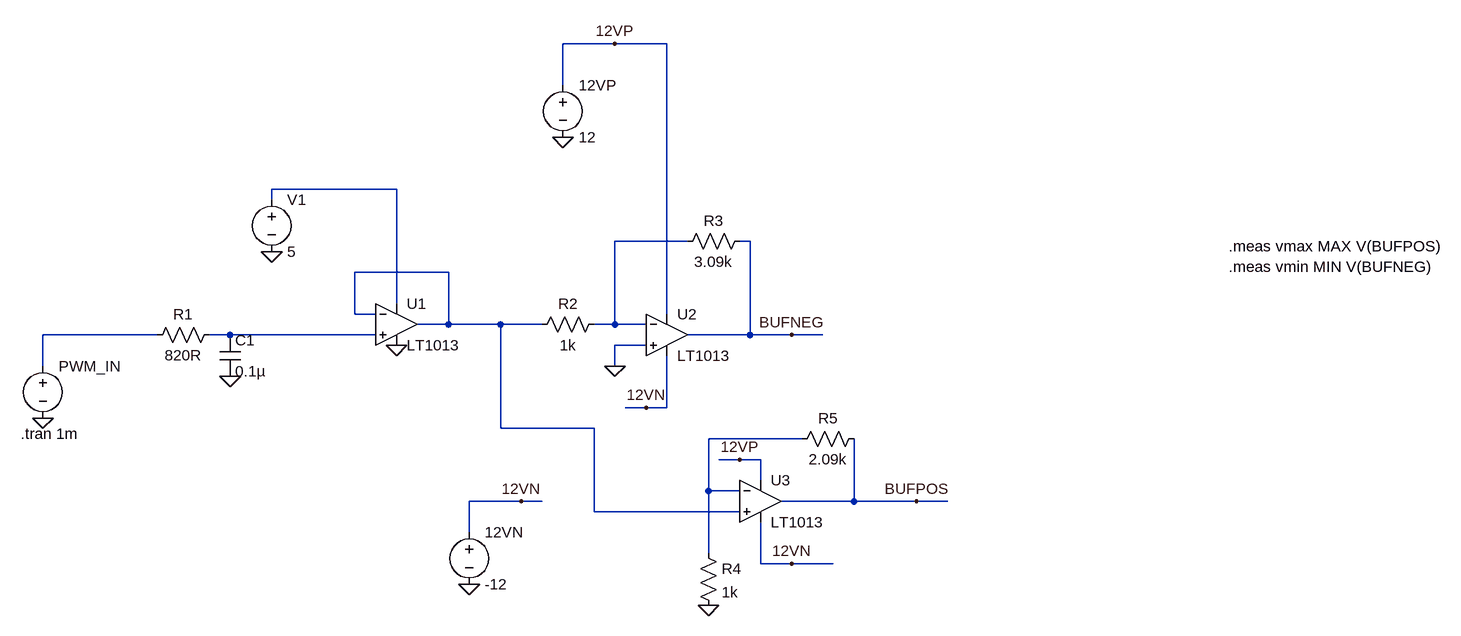
[diagram p0: schematic pwmdir-to-analog.asc]
pwmdir-to-analog.asc, the LTspice schematic file:
Version 4
SHEET 1 2236 680
WIRE 912 -368 832 -368
WIRE 992 -368 912 -368
WIRE 832 -304 832 -368
WIRE 576 -144 384 -144
WIRE 384 -128 384 -144
WIRE 1024 -64 912 -64
WIRE 1120 -64 1104 -64
WIRE 656 -16 512 -16
WIRE 576 32 576 -144
WIRE 512 48 512 -16
WIRE 544 48 512 48
WIRE 992 48 992 -368
WIRE 656 64 656 -16
WIRE 656 64 608 64
WIRE 736 64 656 64
WIRE 800 64 736 64
WIRE 912 64 912 -64
WIRE 912 64 880 64
WIRE 960 64 912 64
WIRE 208 80 32 80
WIRE 320 80 288 80
WIRE 544 80 320 80
WIRE 1120 80 1120 -64
WIRE 1120 80 1024 80
WIRE 1184 80 1120 80
WIRE 1232 80 1184 80
WIRE 960 96 912 96
WIRE 32 128 32 80
WIRE 912 128 912 96
WIRE 960 192 928 192
WIRE 992 192 992 112
WIRE 992 192 960 192
WIRE 736 224 736 64
WIRE 880 224 736 224
WIRE 1200 240 1056 240
WIRE 1104 272 1072 272
WIRE 1136 272 1104 272
WIRE 1136 304 1136 272
WIRE 1056 320 1056 240
WIRE 1104 320 1056 320
WIRE 768 336 688 336
WIRE 800 336 768 336
WIRE 1280 336 1280 240
WIRE 1280 336 1168 336
WIRE 1376 336 1280 336
WIRE 1424 336 1376 336
WIRE 880 352 880 224
WIRE 1104 352 880 352
WIRE 688 384 688 336
WIRE 1056 416 1056 320
WIRE 1136 432 1136 368
WIRE 1184 432 1136 432
WIRE 1248 432 1184 432
FLAG 32 208 0
FLAG 320 144 0
FLAG 384 -48 0
FLAG 576 96 0
FLAG 832 -224 0
FLAG 688 464 0
FLAG 912 -368 12VP
FLAG 768 336 12VN
FLAG 960 192 12VN
FLAG 912 128 0
FLAG 1184 80 BUFNEG
FLAG 1056 496 0
FLAG 1376 336 BUFPOS
FLAG 1184 432 12VN
FLAG 1104 272 12VP
SYMBOL voltage 32 112 R0
WINDOW 3 24 96 Invisible 2
WINDOW 123 0 0 Left 0
WINDOW 39 0 0 Left 0
SYMATTR InstName PWM_IN
SYMATTR Value PULSE(0 3.3 0 10n 10n 0.5u 1u)
SYMBOL res 304 64 R90
WINDOW 0 0 56 VBottom 2
WINDOW 3 32 56 VTop 2
SYMATTR InstName R1
SYMATTR Value 820R
SYMBOL cap 304 80 R0
SYMATTR InstName C1
SYMATTR Value 0.1µ
SYMBOL OpAmps\\LT1013 576 0 R0
SYMATTR InstName U1
SYMBOL voltage 384 -144 R0
WINDOW 123 0 0 Left 0
WINDOW 39 0 0 Left 0
SYMATTR InstName V1
SYMATTR Value 5
SYMBOL OpAmps\\LT1013 992 16 R0
SYMATTR InstName U2
SYMBOL res 896 48 R90
WINDOW 0 0 56 VBottom 2
WINDOW 3 32 56 VTop 2
SYMATTR InstName R2
SYMATTR Value 1k
SYMBOL voltage 832 -320 R0
WINDOW 123 0 0 Left 0
WINDOW 39 0 0 Left 0
SYMATTR InstName 12VP
SYMATTR Value 12
SYMBOL voltage 688 368 R0
WINDOW 123 0 0 Left 0
WINDOW 39 0 0 Left 0
SYMATTR InstName 12VN
SYMATTR Value -12
SYMBOL res 1120 -80 R90
WINDOW 0 0 56 VBottom 2
WINDOW 3 32 56 VTop 2
SYMATTR InstName R3
SYMATTR Value 3.09k
SYMBOL OpAmps\\LT1013 1136 272 R0
SYMATTR InstName U3
SYMBOL res 1040 400 R0
SYMATTR InstName R4
SYMATTR Value 1k
SYMBOL res 1296 224 R90
WINDOW 0 0 56 VBottom 2
WINDOW 3 32 56 VTop 2
SYMATTR InstName R5
SYMATTR Value 2.09k
TEXT -2 232 Left 2 !.tran 1m
TEXT 1856 -56 Left 2 !.meas vmax MAX V(BUFPOS)\n.meas vmin MIN V(BUFNEG)

The netlist it stands for:
* pwmdir-to-analog.asc
V§PWM_IN N004 0 PULSE(0 3.3 0 10n 10n 0.5u 1u)
R1 N005 N004 820R
C1 N005 0 0.1µ
XU1 N005 N003 N001 0 N003 LT1013  ; pins In+ In- V+ V- OUT
V1 N001 0 5
XU2 0 N002 12VP 12VN BUFNEG LT1013  ; pins In+ In- V+ V- OUT
R2 N002 N003 1k
V§12VP 12VP 0 12
V§12VN 12VN 0 -12
R3 BUFNEG N002 3.09k
XU3 N003 N006 12VP 12VN BUFPOS LT1013  ; pins In+ In- V+ V- OUT
R4 N006 0 1k
R5 BUFPOS N006 2.09k
.tran 1m
.meas vmax MAX V(BUFPOS)
.meas vmin MIN V(BUFNEG)
.lib LTC.lib
.backanno
.end